# EAGLE design 3_channel_relay_board (EAGLE 6.1)
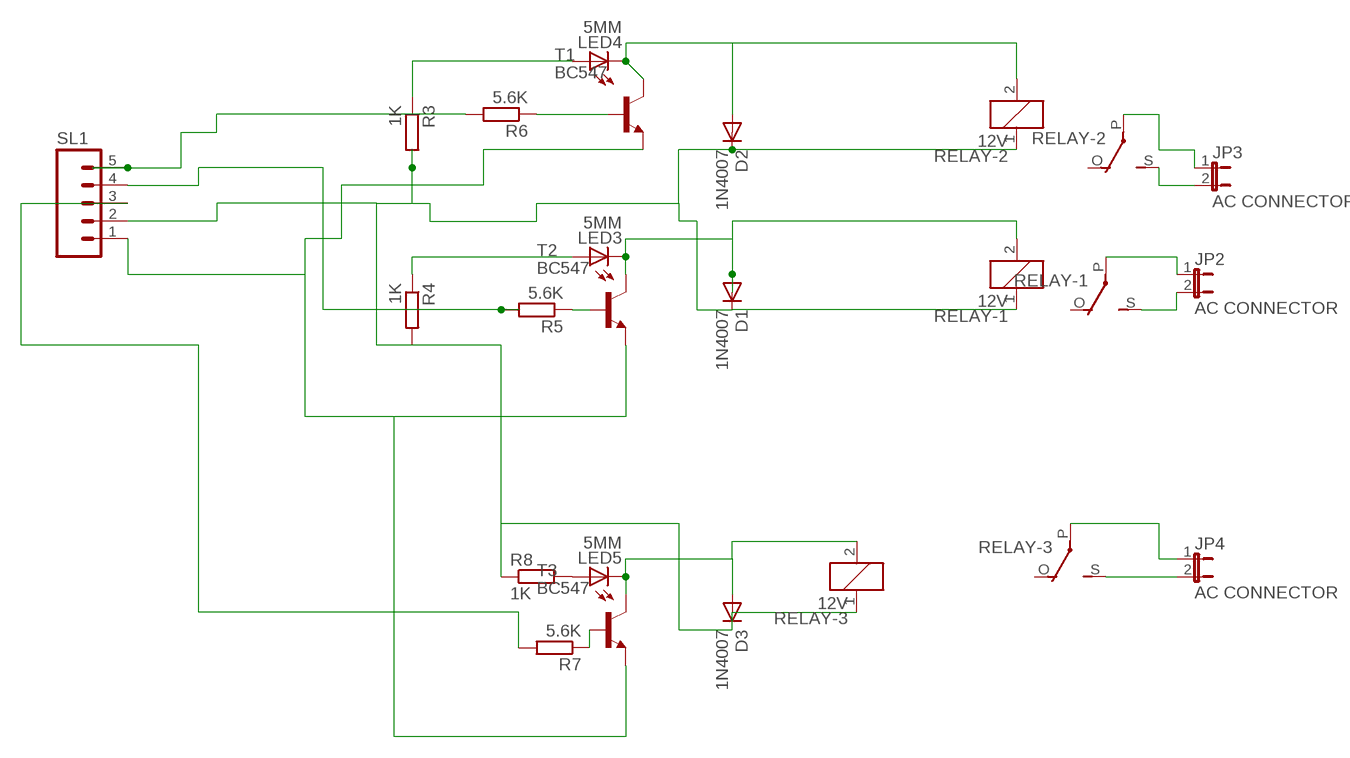
[diagram p0: schematic, sheet 1]

## Parts
D1  1N4007  1N4004  [DO41-10]
D2  1N4007  1N4004  [DO41-10]
D3  1N4007  1N4004  [DO41-10]
JP2  AC CONNECTOR  JP1E  [JP1]
JP3  AC CONNECTOR  JP1E  [JP1]
JP4  AC CONNECTOR  JP1E  [JP1]
LED3  5MM  LED5MM  [LED5MM]
LED4  5MM  LED5MM  [LED5MM]
LED5  5MM  LED5MM  [LED5MM]
R3  1K  R-EU_0204/7  [0204/7]
R4  1K  R-EU_0204/7  [0204/7]
R5  5.6K  R-EU_0204/7  [0204/7]
R6  5.6K  R-EU_0204/7  [0204/7]
R7  5.6K  R-EU_0204/7  [0204/7]
R8  1K  R-EU_0204/7  [0204/7]
RELAY-1  12V  G5L  [G5LE]
RELAY-2  12V  G5L  [G5LE]
RELAY-3  12V  G5L  [G5LE]
SL1  M05  [05P]
T1  BC547  [TO92]
T2  BC547  [TO92]
T3  BC547  [TO92]

## Nets
N$3: D1.A LED3.K(C) RELAY-1.2 T2.3(C)
N$16: SL1.1 T1.1(E) T2.1(E) T3.1(E)
N$31: R7.2 SL1.3
N$32: R6.2 SL1.5
N$38: D1.C D2.C D3.C R3.2 R4.2 R8.1 RELAY-1.1 RELAY-2.1 RELAY-3.1 SL1.2
N$40: R6.1 T1.2(B)
N$44: R5.1 T2.2(B)
N$48: LED3.A R4.1
N$49: LED4.A R3.1
N$50: JP2.2 RELAY-1.S(2:S)
N$51: JP2.1 RELAY-1.P(2:P)
N$52: JP3.1 RELAY-2.P(2:P)
N$54: R5.2 SL1.4
N$56: D2.A LED4.K(C) RELAY-2.2 T1.3(C)
N$57: JP3.2 RELAY-2.S(2:S)
N$58: D3.A LED5.K(C) RELAY-3.2 T3.3(C)
N$59: R7.1 T3.2(B)
N$60: LED5.A R8.2
N$61: JP4.1 RELAY-3.P(2:P)
N$62: JP4.2 RELAY-3.S(2:S)
Unconnected: RELAY-1.O(2:O) RELAY-2.O(2:O) RELAY-3.O(2:O)

## Library data of the parts
D1-D3 = diode:1N4004: DIODE general purpose rectifier, 1 A
JP2-JP4 = jumper:JP1E: JUMPER
LED3-LED5 = led:LED: LED OSRAM: - CHIPLED LG R971, LG N971, LY N971, LG Q971, LY Q971, LO R971, LY R971 LH N974, LH R974 LS Q976, LO Q976, LY Q976 LO Q996 - Hyper CHIPLED LW Q18S LB Q993, LB Q99A, LB R99A - SideLED LS A670, LO A670, LY A670, LG A670, LP A670 LB A673, LV A673, LT A673, LW A673 LH A674 LY A675 LS A676, LA A676, LO A676, LY A676, LW A676 LS A679, LY A679, LG A679 - Hyper Micro SIDELED® LS Y876, LA Y876, LO Y876, LY Y876 LT Y87S - SmartLED LW L88C, LW L88S LB L89C, LB L89S, LG L890 LS L89K, LO L89K, LY L89K LS L896, LA L896, LO L896, LY L896 - TOPLED LS T670, LO T670, LY T670, LG T670, LP T670 LSG T670, LSP T670, LSY T670, LOP T670, LYG T670 LG T671, LOG T671, LSG T671 LB T673, LV T673, LT T673, LW T673 LH T674 LS T676, LA T676, LO T676, LY T676, LB T676, LH T676, LSB T676, LW T676 LB T67C, LV T67C, LT T67C, LS T67K, LO T67K, LY T67K, LW E67C LS E67B, LA E67B, LO E67B, LY E67B, LB E67C, LV E67C, LT E67C LW T67C LS T679, LY T679, LG T679 LS T770, LO T770, LY T770, LG T770, LP T770 LB T773, LV T773, LT T773, LW T773 LH T774 LS E675, LA E675, LY E675, LS T675 LS T776, LA T776, LO T776, LY T776, LB T776 LHGB T686 LT T68C, LB T68C - Hyper Mini TOPLED® LB M676 - Mini TOPLED Santana® LG M470 LS M47K, LO M47K, LY M47K Source: http://www.osram.convergy.de LUXEON: - LUMILED® LXK2-PW12-R00, LXK2-PW12-S00, LXK2-PW14-U00, LXK2-PW14-V00 LXK2-PM12-R00, LXK2-PM12-S00, LXK2-PM14-U00 LXK2-PE12-Q00, LXK2-PE12-R00, LXK2-PE12-S00, LXK2-PE14-T00, LXK2-PE14-U00 LXK2-PB12-K00, LXK2-PB12-L00, LXK2-PB12-M00, LXK2-PB14-N00, LXK2-PB14-P00, LXK2-PB14-Q00 LXK2-PR12-L00, LXK2-PR12-M00, LXK2-PR14-Q00, LXK2-PR14-R00 LXK2-PD12-Q00, LXK2-PD12-R00, LXK2-PD12-S00 LXK2-PH12-R00, LXK2-PH12-S00 LXK2-PL12-P00, LXK2-PL12-Q00, LXK2-PL12-R00 Source: www.luxeon.com KINGBRIGHT: KA-3528ASYC Source: www.kingbright.com
R3-R8 = rcl:R-EU_: RESISTOR, European symbol
RELAY-1-RELAY-3 = relay:G5L: RELAY 1 x switch, 10 A/120 V AC, 8 A/30 V ADC, Omron; OC_FARNELL: unknown; OC_NEWARK: unknown
SL1 = con-amp-quick:M05: AMP QUICK CONNECTOR; OC_FARNELL: unknown; OC_NEWARK: unknown
T1-T3 = transistor:BC547: NPN TRANSISTOR

## Board
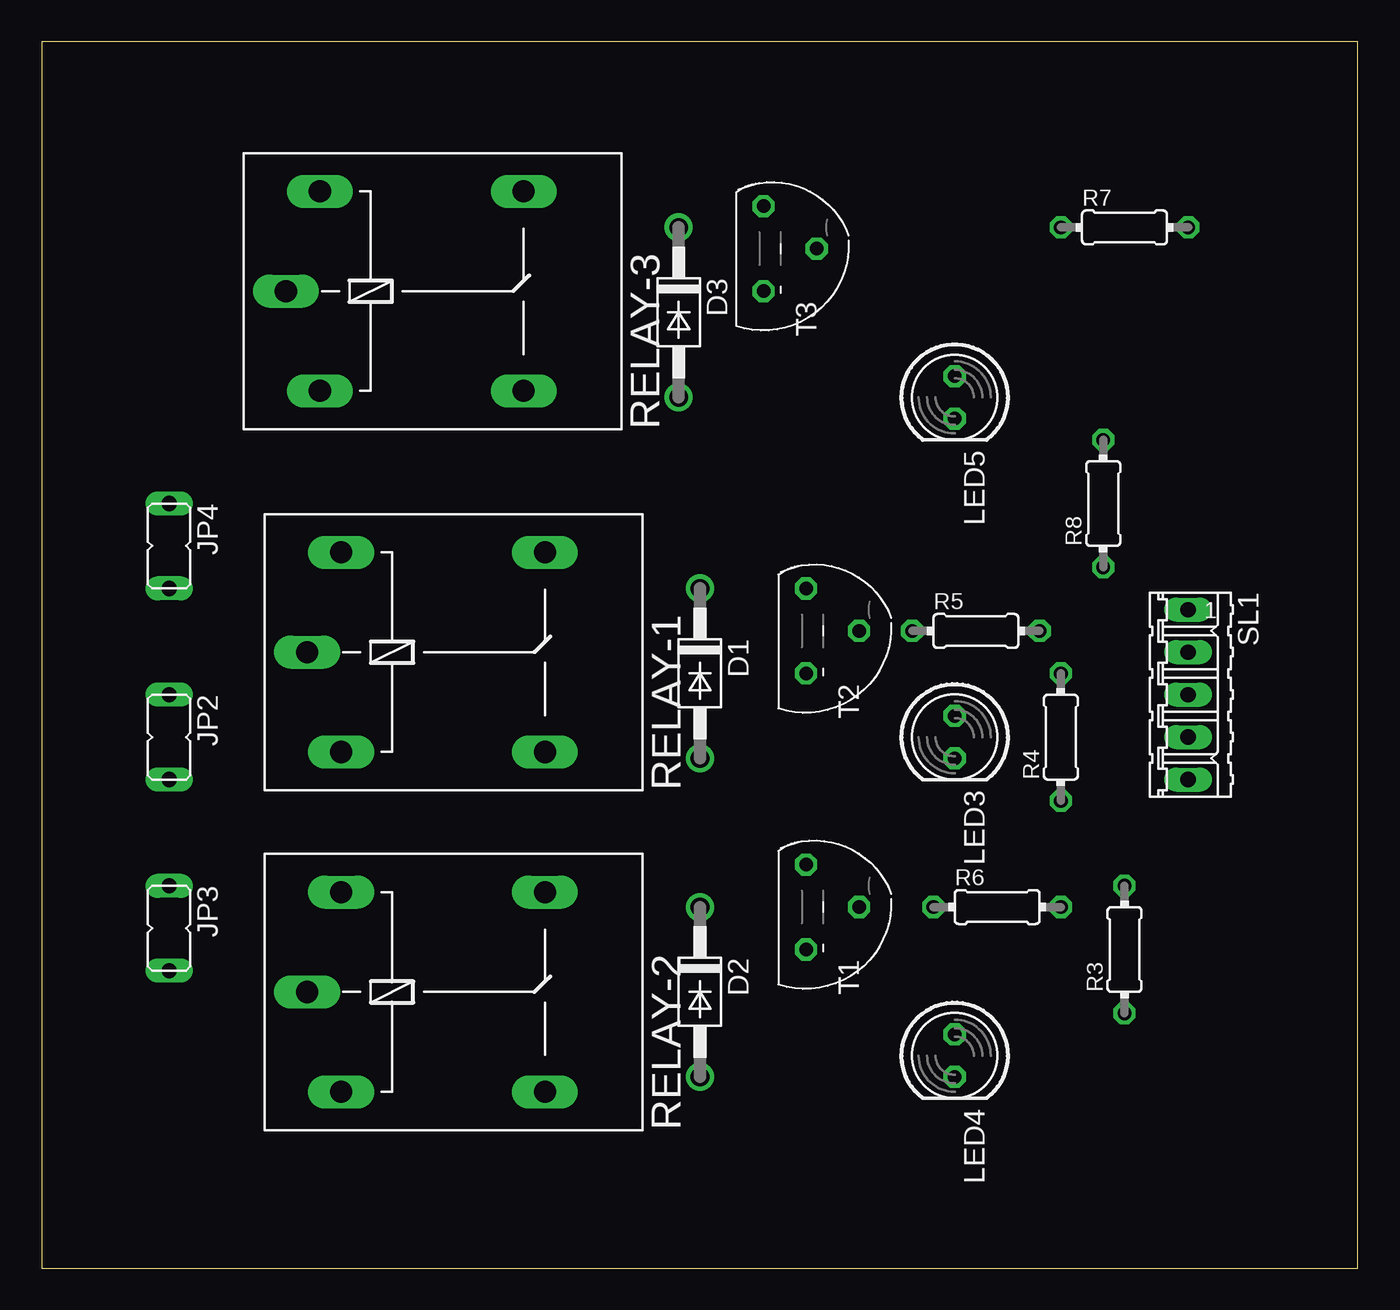
[diagram p1: board, top side]
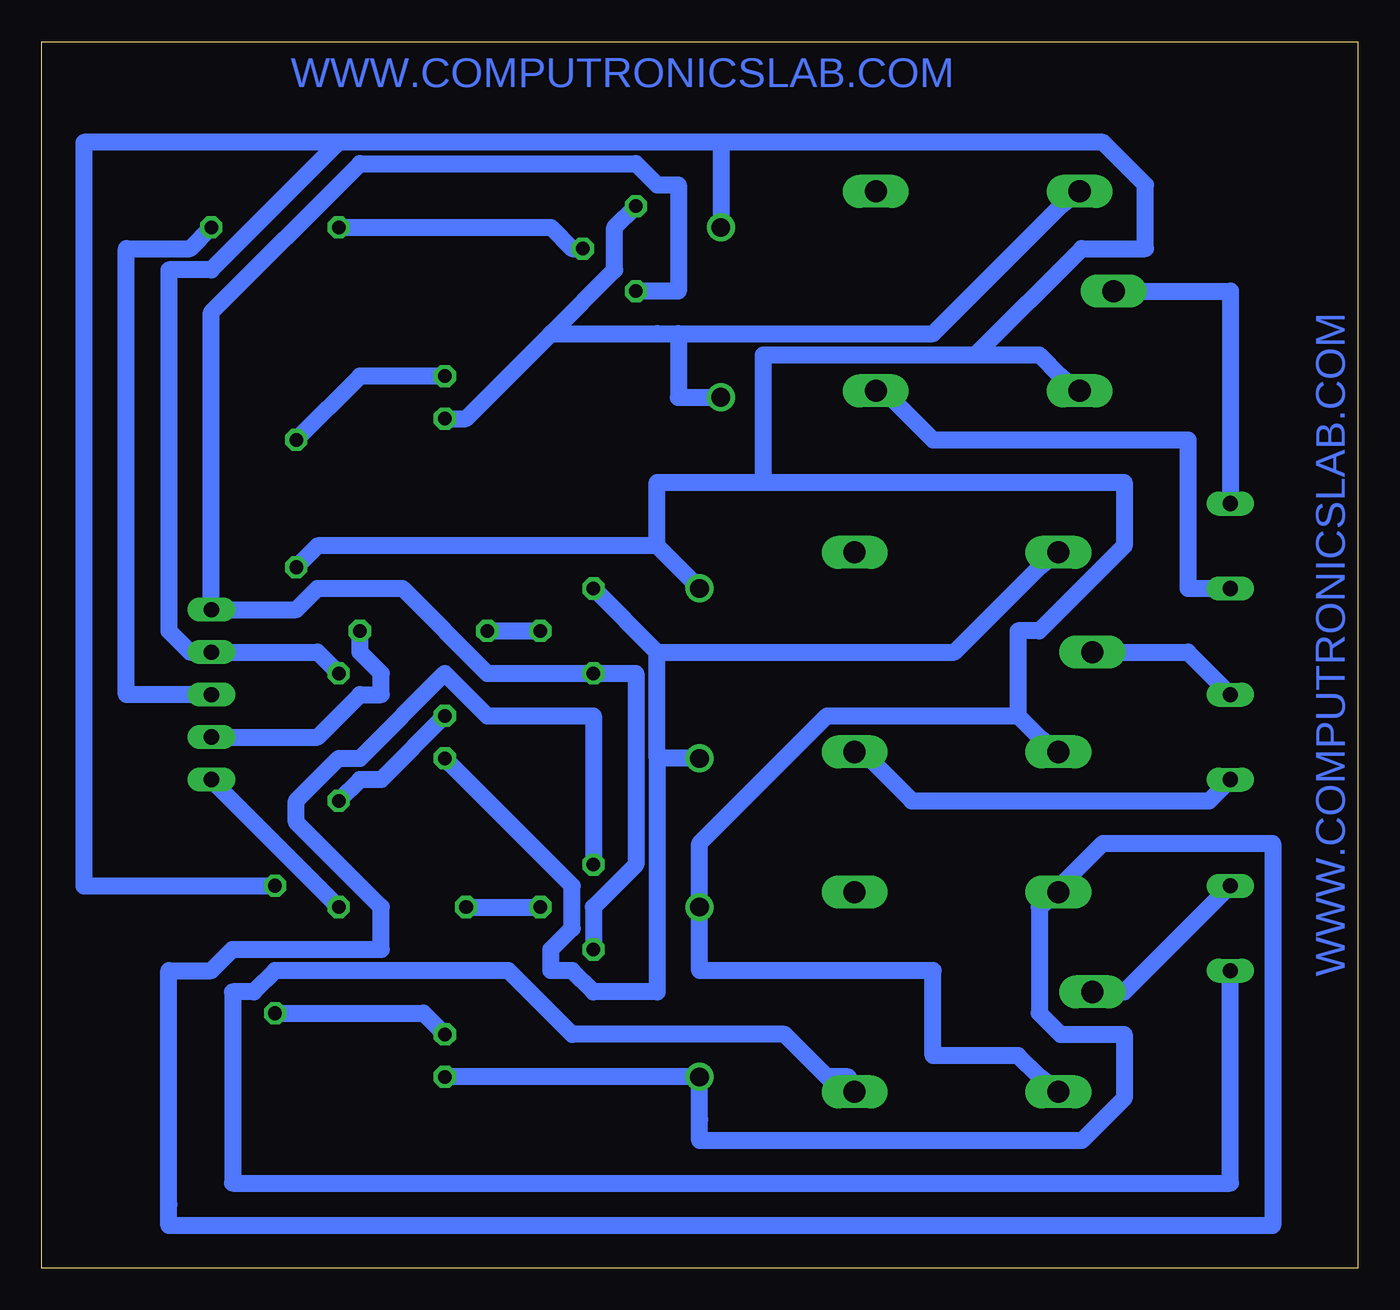
[diagram p2: board, bottom side, seen from below]

Size 78.72 x 73.33 mm. Coordinates in mm from the lower left corner, seen from the top.
Outline: 0,0 78.72,0 78.72,73.33 0,73.33 0,0
Copper layers (1*16): Top 0.035mm / dielectric 1.5mm / Bottom 0.035mm
Design rules: minimum track width 40mil, minimum drill 24mil, track to track 8mil, track to pad 8mil, pad to pad 8mil, via to via 8mil, smd to smd 8mil, copper to edge 40mil, drill to drill 8mil, minimum pad ring 10mil, minimum via ring 8mil, stop-mask expansion 4mil, vias tented up to drill 0mil, thermal gap 10mil

### Footprints (pad centres in the part's own frame; a part is rotated, then mirrored left to right if it is on the bottom)
DO41-10 = drill 1.118: A 5.08,0; C -5.08,0
JP1 = drill 0.914 long: 1 0,-2.54; 2 0,2.54
LED5MM = drill 0.813 octagon: A -1.27,0; K 1.27,0
0204/7 = drill 0.813 octagon: 1 -3.81,0; 2 3.81,0
G5LE = drill 1.321 long: 1 -7.493,-5.969; 2 -7.493,5.969; O 4.699,5.969; P -9.525,0; S 4.699,-5.969
05P = drill 0.914 long: 1 -5.08,0; 2 -2.54,0; 3 0,0; 4 2.54,0; 5 5.08,0
TO92 = drill 0.813 octagon: 1 2.54,-1.27; 2 0,1.905; 3 -2.54,-1.27

### Placement (x,y rotation side)
D1  39.37,35.56 270 top
D2  39.37,16.51 270 top
D3  38.1,57.15 270 top
JP2  7.62,31.75 180 top
JP3  7.62,20.32 180 top
JP4  7.62,43.18 180 top
LED3  54.61,31.75 270 top
LED4  54.61,12.7 270 top
LED5  54.61,52.07 270 top
R3  64.77,19.05 90 top
R4  60.96,31.75 90 top
R5  55.88,38.1 0 top
R6  57.15,21.59 0 top
R7  64.77,62.23 0 top
R8  63.5,45.72 90 top
RELAY-1  25.4,36.83 0 top
RELAY-2  25.4,16.51 0 top
RELAY-3  24.13,58.42 0 top
SL1  68.58,34.29 270 top
T1  46.99,21.59 270 top
T2  46.99,38.1 270 top
T3  44.45,60.96 270 top

### Tracks (layer width: path | path; a pad name or v marks a point on that pad's centre or on a via)
N$3
  Bottom 1.016: LED3.K 46.99,22.86 46.99,20.32 48.26,19.05 48.26,17.78 46.99,17.78 45.72,16.51 41.91,16.51 41.91,30.48 | D1.A 41.91,30.48 | 41.91,36.83 T2.3 | 41.91,30.48 41.91,36.83 | 41.91,36.83 24.13,36.83 19.05,41.91 RELAY-1.2
N$16
  Bottom 1.016: T1.1 45.72,21.59 43.18,24.13 43.18,35.56 T2.1 52.07,35.56 57.15,40.64 62.23,40.64 63.5,39.37 SL1.1 68.58,57.15 59.69,66.04 43.18,66.04 41.91,64.77 40.64,64.77 40.64,58.42 T3.1
N$31
  Bottom 1.016: R7.2 69.85,60.96 73.66,60.96 73.66,34.29 SL1.3
N$32
  Bottom 1.016: SL1.5 R6.2
N$38
  Bottom 1.016: R4.2 62.23,36.83 SL1.2 69.85,36.83 71.12,38.1 71.12,59.69 68.58,59.69 60.96,67.31 | R3.2 76.2,22.86 76.2,67.31 60.96,67.31 | 38.1,67.31 60.96,67.31 | RELAY-2.1 19.05,11.43 20.32,12.7 25.4,12.7 25.4,17.78 39.37,17.78 D2.C 39.37,25.4 31.75,33.02 20.32,33.02 | 20.32,33.02 19.05,31.75 RELAY-1.1 | R8.1 62.23,43.18 41.91,43.18 | D1.C 41.91,43.18 | 22.86,54.61 35.56,54.61 35.56,46.99 | 22.86,54.61 19.05,54.61 17.78,53.34 RELAY-3.1 | 41.91,43.18 41.91,46.99 36.83,46.99 35.56,46.99 | 20.32,33.02 20.32,38.1 19.05,38.1 13.97,43.18 13.97,46.99 35.56,46.99 | 38.1,67.31 D3.C | 38.1,67.31 15.24,67.31 12.7,64.77 12.7,60.96 16.51,60.96 22.86,54.61
N$40
  Bottom 1.016: R6.1 T1.2
N$44
  Bottom 1.016: R5.1 T2.2
N$48
  Bottom 1.016: R4.1 59.69,29.21 58.42,29.21 LED3.A
N$49
  Bottom 1.016: LED4.A 55.88,15.24 R3.1
N$50
  Bottom 1.016: JP2.2 8.89,27.94 26.67,27.94 29.21,30.48 RELAY-1.S
N$51
  Bottom 1.016: JP2.1 10.16,36.83 RELAY-1.P
N$52
  Bottom 1.016: JP3.1 13.97,16.51 RELAY-2.P
N$54
  Bottom 1.016: R5.2 59.69,36.83 58.42,35.56 58.42,34.29 59.69,34.29 62.23,31.75 SL1.4
N$56
  Bottom 1.016: LED4.K D2.A 39.37,8.89 39.37,7.62 35.56,7.62 16.51,7.62 13.97,10.16 13.97,13.97 17.78,13.97 19.05,15.24 19.05,21.59 RELAY-2.2 17.78,22.86 15.24,25.4 5.08,25.4 5.08,2.54 60.96,2.54 71.12,2.54 71.12,3.81 71.12,17.78 68.58,17.78 67.31,19.05 58.42,19.05 58.42,21.59 63.5,26.67 63.5,27.94 60.96,30.48 59.69,30.48 54.61,35.56 52.07,33.02 45.72,33.02 T1.3
N$57
  Bottom 1.016: JP3.2 7.62,5.08 67.31,5.08 67.31,16.51 66.04,16.51 64.77,17.78 50.8,17.78 46.99,13.97 34.29,13.97 31.75,11.43 30.48,11.43 RELAY-2.S
N$58
  Bottom 1.016: T3.3 44.45,62.23 44.45,59.69 48.26,55.88 | 48.26,55.88 53.34,50.8 LED5.K | 40.64,55.88 41.91,55.88 48.26,55.88 | 40.64,55.88 40.64,52.07 D3.A | 40.64,55.88 25.4,55.88 17.78,63.5 RELAY-3.2
N$59
  Bottom 1.016: R7.1 48.26,62.23 46.99,60.96 T3.2
N$60
  Bottom 1.016: R8.2 59.69,53.34 LED5.A
N$61
  Bottom 1.016: JP4.1 7.62,58.42 RELAY-3.P
N$62
  Bottom 1.016: JP4.2 10.16,40.64 10.16,49.53 25.4,49.53 27.94,52.07 RELAY-3.S

### Text on the board
Bottom: WWW.COMPUTRONICSLAB.COM | WWW.COMPUTRONICSLAB.COM